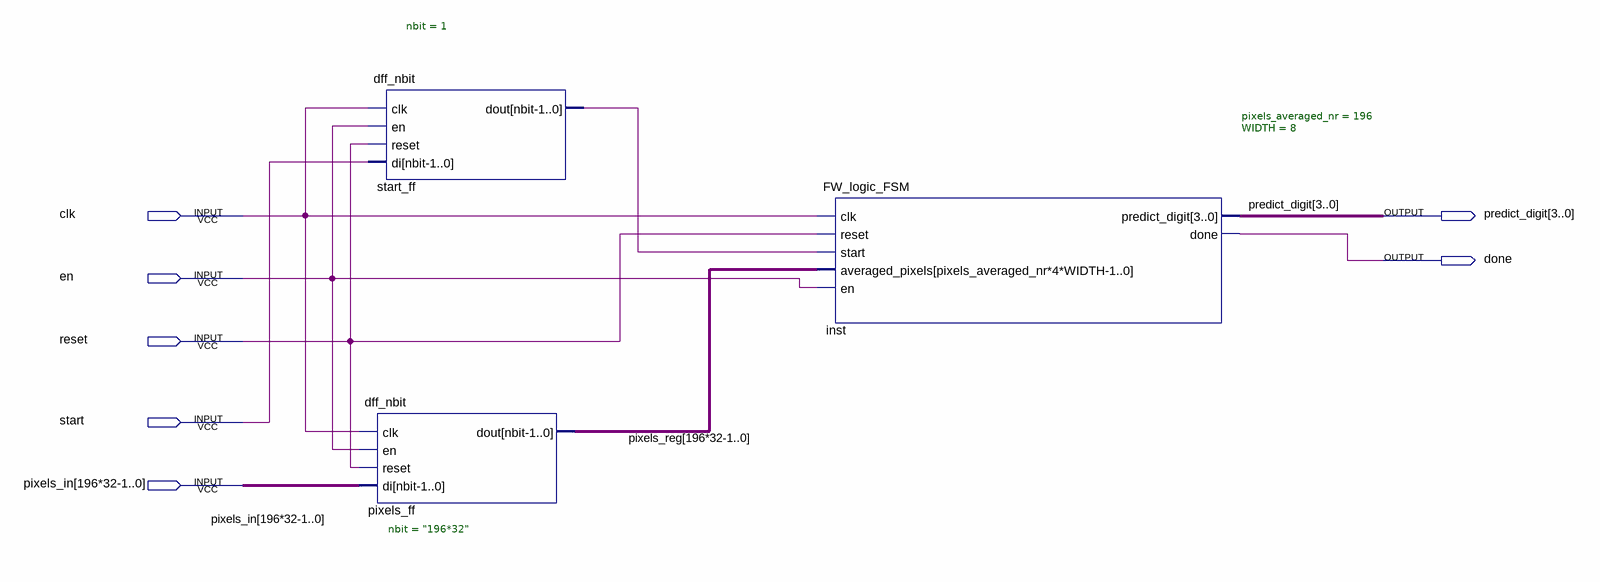
[diagram p0: schematic sheet]
// Quartus schematic FW_logic_FSM_wrapper.bdf as structural Verilog: 3 symbols, 7 pins
module FW_logic_FSM_wrapper (
  input  clk,
  input  en,
  input  reset,
  input  start,
  input  \pixels_in[196*32-1..0] ,
  output [3:0] predict_digit,
  output done
);

  wire \pixels_reg[196*32-1..0] , start_ff_dout;

  dff_nbit #(.nbit("196*32")) pixels_ff (
    .clk(clk), .en(en), .reset(reset), .di(\pixels_in[196*32-1..0] ), .dout(\pixels_reg[196*32-1..0] ));
  dff_nbit #(.nbit(1)) start_ff (.clk(clk), .en(en), .reset(reset), .di(start), .dout(start_ff_dout));
  FW_logic_FSM #(.pixels_averaged_nr(196), .WIDTH(8)) inst (
    .clk(clk), .reset(reset), .start(start_ff_dout), .averaged_pixels(\pixels_reg[196*32-1..0] ), .en(en),
    .predict_digit(predict_digit), .done(done));
endmodule
